# Altium schematic sheet SENSORES.SchDoc: Sensores
size A4; Engineer: Nuria Parra; Revision: 1
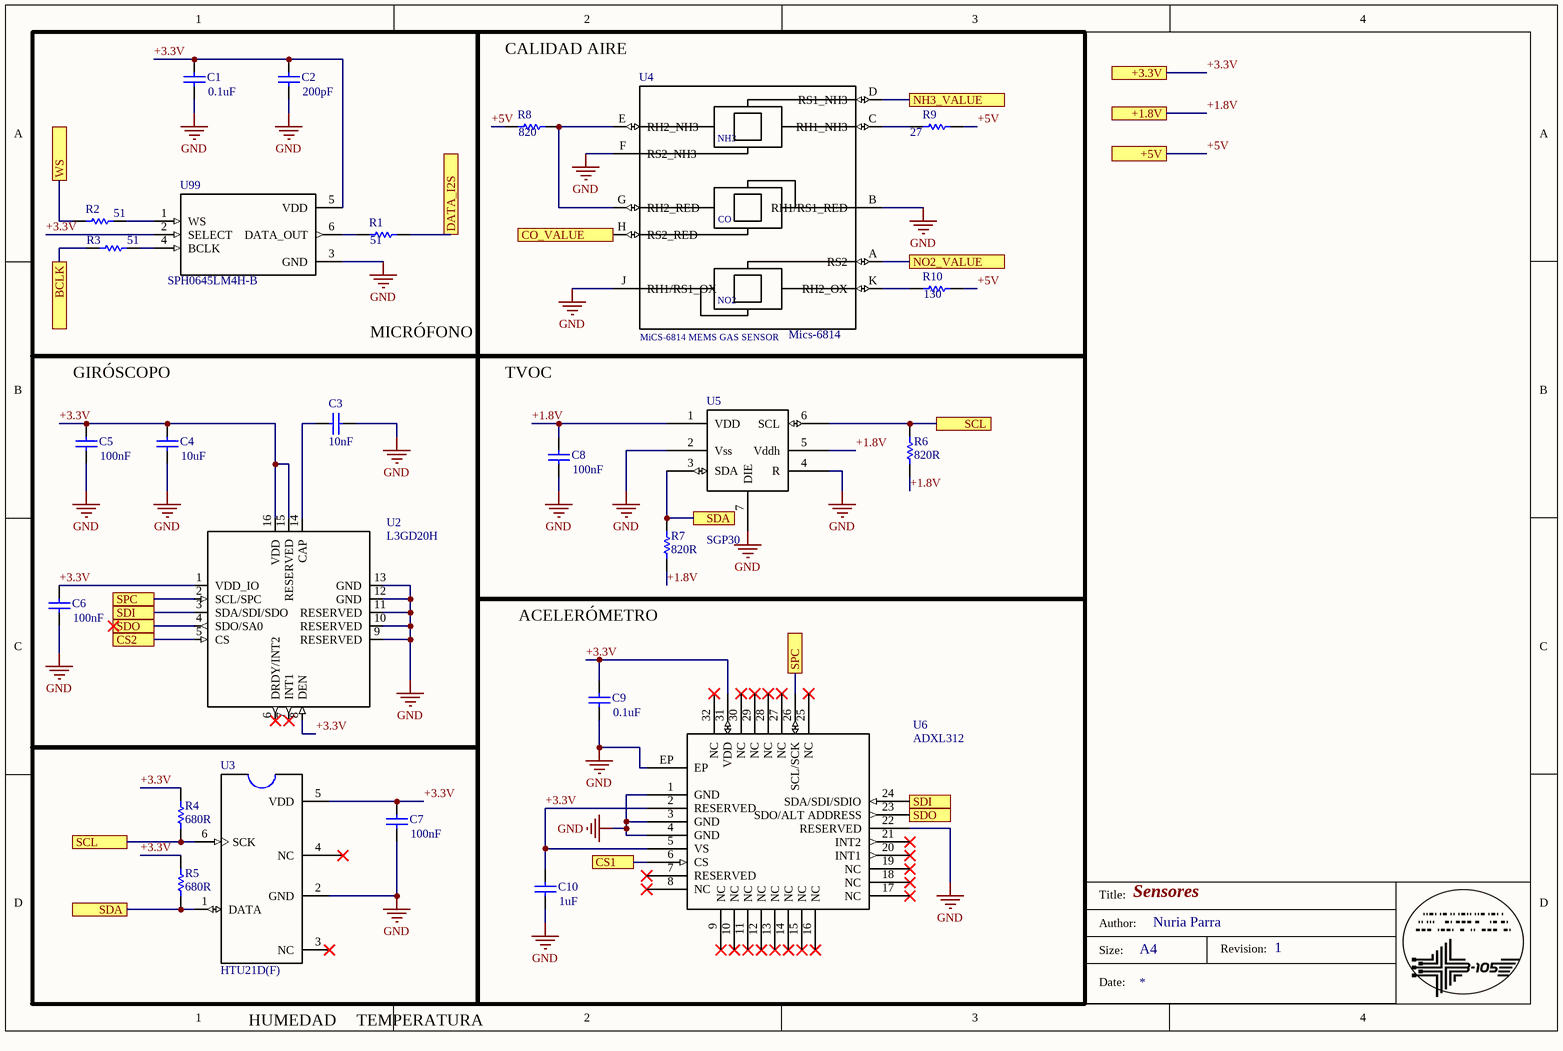
[diagram p0: SENSORES.SchDoc]

## Parts
C1  value 0.1uF  [0603 Cap]  (hidden comment: Cap)
C2  value 200pF  [0603 Cap]  (hidden comment: Cap)
C3  value 10nF  [0603 Cap]  (hidden comment: Cap)
C4  value 10uF  [0603 Cap]  (hidden comment: Cap)
C5  value 100nF  [0603 Cap]  (hidden comment: Cap)
C6  value 100nF  [0603 Cap]  (hidden comment: Cap)
C7  value 100nF  [0603 Cap]  (hidden comment: Cap)
C8  value 100nF  [0603 Cap]  (hidden comment: Cap)
C9  value 0.1uF  [0603 Cap]  (hidden comment: Cap)
C10  value 1uF  [0603 Cap]  (hidden comment: Cap)
R1  51  [0603 Res]
R2  51  [0603 Res]
R3  51  [0603 Res]
R4  value 680R  [0603 Res]  (hidden comment: 27)
R5  value 680R  [0603 Res]  (hidden comment: 27)
R6  value 820R  [0603 Res]  (hidden comment: 27)
R7  value 820R  [0603 Res]  (hidden comment: 27)
R8  value 820  [0603 Res]  (hidden comment: 51)
R9  27  [0603 Res]
R10  130  [0603 Res]
U2  L3GD20H  [Giroscopo]
U3  HTU21D(F)  [TempeYHumedad]
U4  Mics-6814  [mics6814]
U5  SGP30  [sgp30]
U6  ADXL312  [Acelerometro]
U99  SPH0645LM4H-B  [microfono]

## Blocks framed on the sheet
MICRÓFONO: C1 C2 R1-R3 U99
CALIDAD AIRE: R8-R10 U4
GIRÓSCOPO: C3-C6 U2
TVOC: C8 R6 R7 U5
ACELERÓMETRO: C9 C10 U6

## Ports
+1.8V, +3.3V, +5V, BCLK, CO_VALUE, CS1, CS2, DATA_I2S, NH3_VALUE, NO2_VALUE, SCL, SDA, SDI, SDO, SPC, WS

## Nets
GND: C1.1 C2.1 C3.1 C4.1 C5.1 C6.1 C7.1 C8.1 C9.1 C10.1 U2.9(RESERVED) U2.10(RESERVED) U2.11(RESERVED) U2.12(GND) U2.13(GND) U3.2(GND) U4.B(RH1/RS1_RED) U4.F(RS2_NH3) U4.J(RH1/RS1_OX) U5.2(Vss) U5.4(R) U5.7(DIE) U6.1(GND) U6.3(GND) U6.4(GND) U6.22(RESERVED) U6.EP U99.3(GND)
+1.8V: C8.2 R6.1 R7.1 U5.1(VDD) U5.5(Vddh) ; port +1.8V
+3.3V: C1.2 C2.2 C4.2 C5.2 C6.2 C7.2 C9.2 C10.2 R4.1 R5.1 U2.1(VDD_IO) U2.8(DEN) U2.15(RESERVED) U2.16(VDD) U3.5(VDD) U6.2(RESERVED) U6.5(VS) U6.31(VDD) U99.2(SELECT) U99.5(VDD) ; port +3.3V
+5V: R8.1 R9.2 R10.2 ; port +5V
BCLK: R3.1 ; port BCLK
CO_VALUE: U4.H(RS2_RED) ; port CO_VALUE
CS1: U6.6(CS) ; port CS1
CS2: U2.5(CS) ; port CS2
DATA_I2S: R1.2 ; port DATA_I2S
NH3_VALUE: U4.D(RS1_NH3) ; port NH3_VALUE
NO2_VALUE: U4.A(RS2) ; port NO2_VALUE
SCL: R4.2 R6.2 U3.6(SCK) U5.6(SCL) ; port SCL
SDA: R5.2 R7.2 U3.1(DATA) U5.3(SDA) ; port SDA
SDI: U2.3(SDA/SDI/SDO) U6.24(SDA/SDI/SDIO) ; port SDI
SDO: U2.4(SDO/SA0) U6.23(SDO/ALT_ADDRESS) ; port SDO
SPC: U2.2(SCL/SPC) U6.26(SCL/SCK) ; port SPC
WS: R2.1 ; port WS
NetC3_2: C3.2 U2.14(CAP)
NetR1_1: R1.1 U99.6(DATA_OUT)
NetR2_2: R2.2 U99.1(WS)
NetR3_2: R3.2 U99.4(BCLK)
NetR8_2: R8.2 U4.E(RH2_NH3) U4.G(RH2_RED)
NetR9_1: R9.1 U4.C(RH1_NH3)
NetR10_1: R10.1 U4.K(RH2_OX)

Not connected (* = marked no-connect by the designer): U2 6(DRDY/INT2)* 7(INT1)*; U3 3(NC)* 4(NC)*; U6 7(RESERVED)* 8(NC)* 9(NC)* 10(NC)* 11(NC)* 12(NC)* 13(NC)* 14(NC)* 15(NC)* 16(NC)* 17(NC)* 18(NC)* 19(NC)* 20(INT1)* 21(INT2)* 25(NC)* 27(NC)* 28(NC)* 29(NC)* 30(NC)* 32(NC)*

## Notes on the sheet
- Conectado por I2S
- Conectado a través de ADC
- Conectado por SPI
- Conectado por I2C
- Conectado por SPI. Condensador de 1u TANTALUM y de 0.1 ceramico
- HUMEDAD
- TEMPERATURA
- Title:
- Size:
- Author:
- Date:
- A4
- Revision:
- (in symbol Mics-6814) NH3; CO; NO2; MiCS-6814 MEMS GAS SENSOR

## Library data of the parts
R1-R10 = Res
  R1-R3: Value: 51
  R9: Value: 27
  R10: Value: 130
U2 = Giroscopo
U3 = TemperaturaHumedad
U6 = Acelerometro
U99 = Microfono